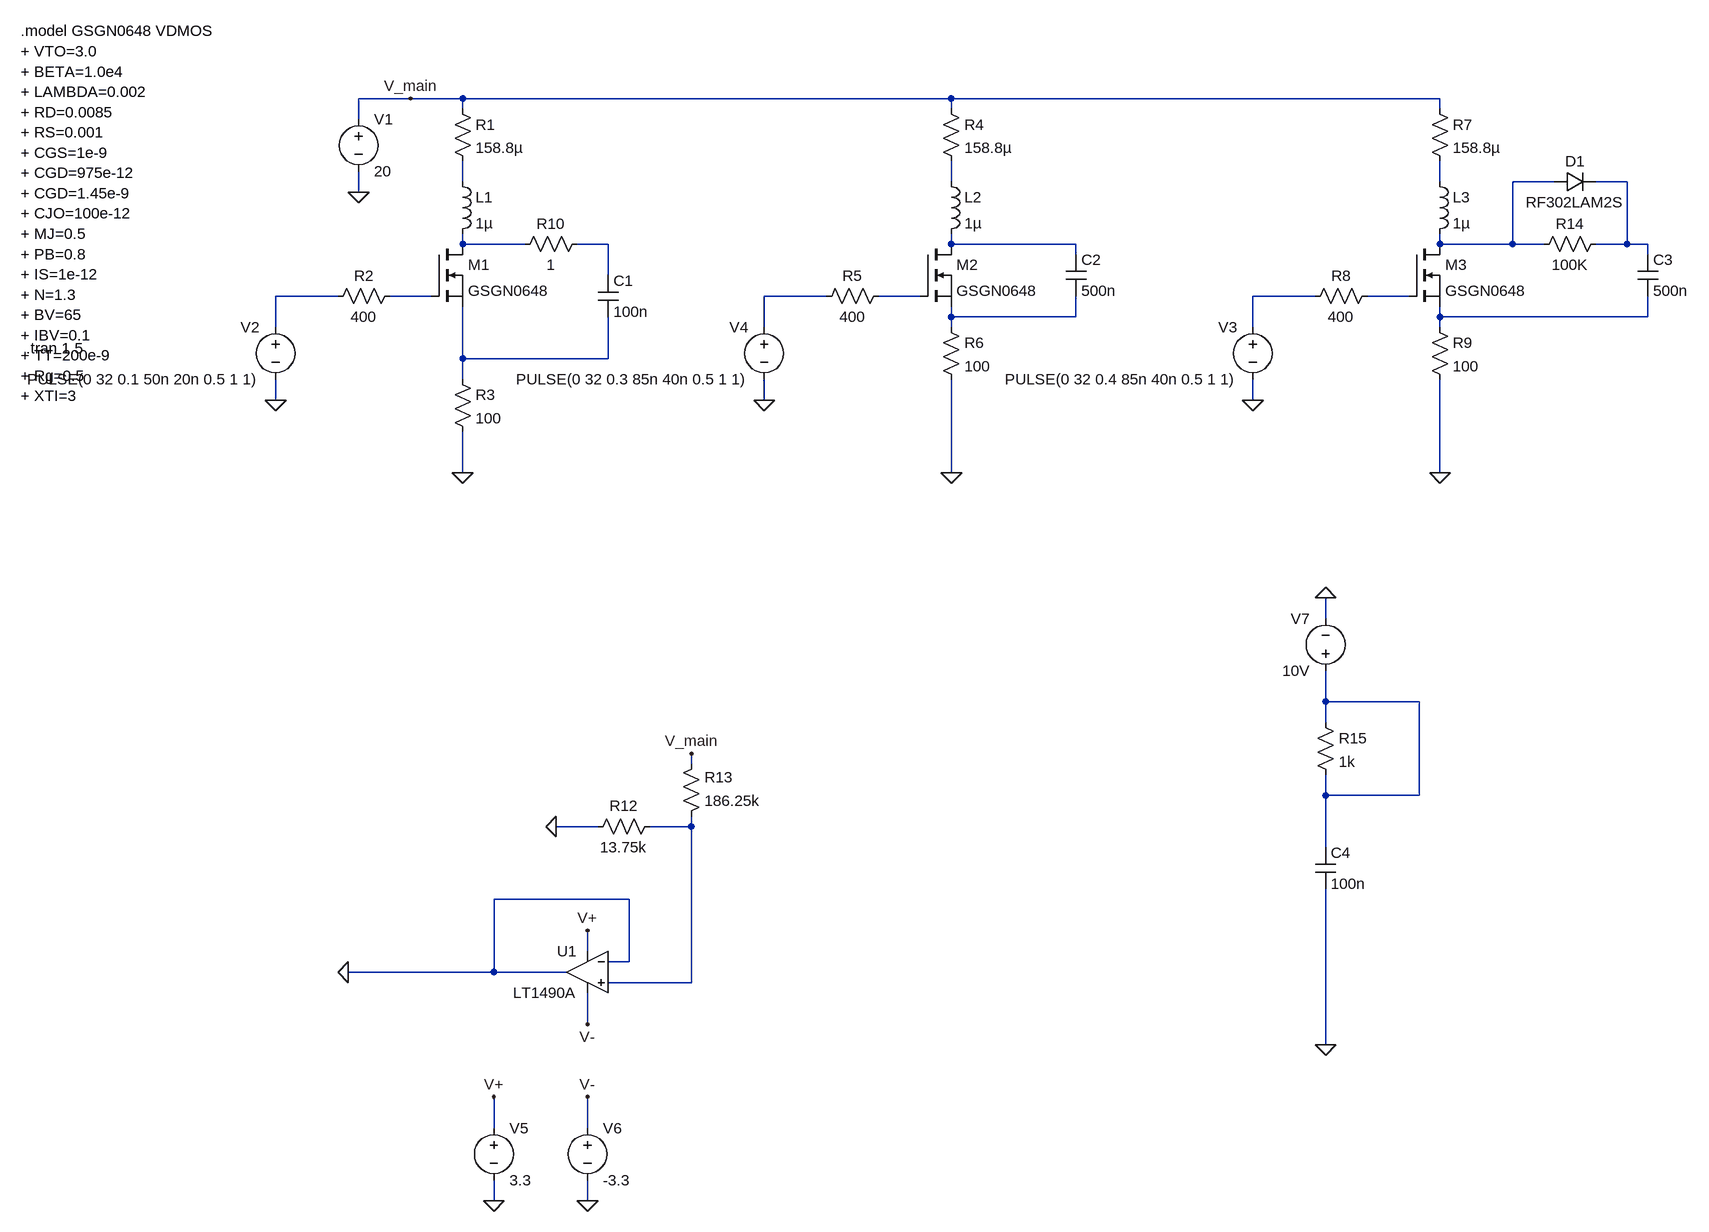
[diagram p0: schematic Snubber_Network.asc]
Snubber_Network.asc, the LTspice schematic file:
Version 4
SHEET 1 3264 1648
WIRE 480 -64 400 -64
WIRE 560 -64 480 -64
WIRE 1312 -64 560 -64
WIRE 2064 -64 1312 -64
WIRE 560 -48 560 -64
WIRE 1312 -48 1312 -64
WIRE 2064 -48 2064 -64
WIRE 400 -32 400 -64
WIRE 560 64 560 32
WIRE 1312 64 1312 32
WIRE 2064 64 2064 32
WIRE 2240 64 2176 64
WIRE 2352 64 2304 64
WIRE 400 80 400 48
WIRE 560 160 560 144
WIRE 656 160 560 160
WIRE 784 160 736 160
WIRE 1312 160 1312 144
WIRE 1504 160 1312 160
WIRE 2064 160 2064 144
WIRE 2176 160 2176 64
WIRE 2176 160 2064 160
WIRE 2224 160 2176 160
WIRE 2352 160 2352 64
WIRE 2352 160 2304 160
WIRE 2384 160 2352 160
WIRE 1504 176 1504 160
WIRE 2384 176 2384 160
WIRE 784 208 784 160
WIRE 368 240 272 240
WIRE 512 240 448 240
WIRE 1120 240 1024 240
WIRE 1264 240 1200 240
WIRE 1872 240 1776 240
WIRE 2016 240 1952 240
WIRE 1312 272 1312 256
WIRE 1504 272 1504 240
WIRE 1504 272 1312 272
WIRE 2064 272 2064 256
WIRE 2384 272 2384 240
WIRE 2384 272 2064 272
WIRE 272 288 272 240
WIRE 1024 288 1024 240
WIRE 1312 288 1312 272
WIRE 1776 288 1776 240
WIRE 2064 288 2064 272
WIRE 560 336 560 256
WIRE 784 336 784 272
WIRE 784 336 560 336
WIRE 560 368 560 336
WIRE 272 400 272 368
WIRE 1024 400 1024 368
WIRE 1776 400 1776 368
WIRE 560 512 560 448
WIRE 1312 512 1312 368
WIRE 2064 512 2064 368
WIRE 1888 736 1888 704
WIRE 1888 864 1888 816
WIRE 2032 864 1888 864
WIRE 1888 896 1888 864
WIRE 912 960 912 944
WIRE 1888 1008 1888 976
WIRE 2032 1008 2032 864
WIRE 2032 1008 1888 1008
WIRE 768 1056 704 1056
WIRE 912 1056 912 1040
WIRE 912 1056 848 1056
WIRE 1888 1088 1888 1008
WIRE 816 1168 608 1168
WIRE 752 1248 752 1216
WIRE 816 1264 816 1168
WIRE 816 1264 784 1264
WIRE 608 1280 608 1168
WIRE 608 1280 384 1280
WIRE 720 1280 608 1280
WIRE 912 1296 912 1056
WIRE 912 1296 784 1296
WIRE 752 1360 752 1312
WIRE 1888 1392 1888 1152
WIRE 608 1520 608 1472
WIRE 752 1520 752 1472
WIRE 608 1632 608 1600
WIRE 752 1632 752 1600
FLAG 560 512 0
FLAG 400 80 0
FLAG 272 400 0
FLAG 1312 512 0
FLAG 1024 400 0
FLAG 2064 512 0
FLAG 1776 400 0
FLAG 608 1632 0
FLAG 608 1472 V+
FLAG 752 1216 V+
FLAG 752 1632 0
FLAG 752 1472 V-
FLAG 752 1360 V-
FLAG 704 1056 0
FLAG 480 -64 V_main
FLAG 912 944 V_main
FLAG 384 1280 0
FLAG 1888 1392 0
FLAG 1888 704 0
SYMBOL voltage 400 -48 R0
SYMATTR InstName V1
SYMATTR Value 20
SYMBOL voltage 272 272 M0
SYMATTR InstName V2
SYMATTR Value PULSE(0 32 0.1 50n 20n 0.5 1 1)
SYMBOL Ind 544 48 R0
SYMATTR InstName L1
SYMATTR Value 1µ
SYMBOL Res 544 -64 R0
SYMATTR InstName R1
SYMATTR Value 158.8µ
SYMBOL Res 464 224 R90
WINDOW 0 0 56 VBottom 2
WINDOW 3 32 56 VTop 2
SYMATTR InstName R2
SYMATTR Value 400
SYMBOL nmos 512 160 R0
SYMATTR InstName M1
SYMATTR Value GSGN0648
SYMBOL voltage 1024 272 M0
SYMATTR InstName V4
SYMATTR Value PULSE(0 32 0.3 85n 40n 0.5 1 1)
SYMBOL Ind 1296 48 R0
SYMATTR InstName L2
SYMATTR Value 1µ
SYMBOL Res 1296 -64 R0
SYMATTR InstName R4
SYMATTR Value 158.8µ
SYMBOL Res 1216 224 R90
WINDOW 0 0 56 VBottom 2
WINDOW 3 32 56 VTop 2
SYMATTR InstName R5
SYMATTR Value 400
SYMBOL Res 1296 272 R0
SYMATTR InstName R6
SYMATTR Value 100
SYMBOL nmos 1264 160 R0
SYMATTR InstName M2
SYMATTR Value GSGN0648
SYMBOL voltage 1776 272 M0
SYMATTR InstName V3
SYMATTR Value PULSE(0 32 0.4 85n 40n 0.5 1 1)
SYMBOL Ind 2048 48 R0
SYMATTR InstName L3
SYMATTR Value 1µ
SYMBOL Res 2048 -64 R0
SYMATTR InstName R7
SYMATTR Value 158.8µ
SYMBOL Res 1968 224 R90
WINDOW 0 0 56 VBottom 2
WINDOW 3 32 56 VTop 2
SYMATTR InstName R8
SYMATTR Value 400
SYMBOL Res 2048 272 R0
SYMATTR InstName R9
SYMATTR Value 100
SYMBOL nmos 2016 160 R0
SYMATTR InstName M3
SYMATTR Value GSGN0648
SYMBOL LT1490A 752 1216 M0
SYMATTR InstName U1
SYMBOL voltage 608 1504 R0
SYMATTR InstName V5
SYMATTR Value 3.3
SYMBOL voltage 752 1504 R0
SYMATTR InstName V6
SYMATTR Value -3.3
SYMBOL Res 864 1040 R90
WINDOW 0 0 56 VBottom 2
WINDOW 3 32 56 VTop 2
SYMATTR InstName R12
SYMATTR Value 13.75k
SYMBOL Res 896 1056 M180
WINDOW 0 36 76 Left 2
WINDOW 3 36 40 Left 2
SYMATTR InstName R13
SYMATTR Value 186.25k
SYMBOL Res 752 144 R90
WINDOW 0 0 56 VBottom 2
WINDOW 3 32 56 VTop 2
SYMATTR InstName R10
SYMATTR Value 1
SYMBOL Cap 768 208 R0
SYMATTR InstName C1
SYMATTR Value 100n
SYMBOL Res 544 352 R0
SYMATTR InstName R3
SYMATTR Value 100
SYMBOL Cap 1488 176 R0
SYMATTR InstName C2
SYMATTR Value 500n
SYMBOL Cap 2368 176 R0
SYMATTR InstName C3
SYMATTR Value 500n
SYMBOL Res 2320 144 R90
WINDOW 0 0 56 VBottom 2
WINDOW 3 32 56 VTop 2
SYMATTR InstName R14
SYMATTR Value 100K
SYMBOL diode 2240 80 R270
WINDOW 0 32 32 VTop 2
WINDOW 3 0 32 VBottom 2
SYMATTR InstName D1
SYMATTR Value RF302LAM2S
SYMBOL voltage 1888 832 R180
WINDOW 0 24 96 Left 2
WINDOW 3 24 16 Left 2
SYMATTR InstName V7
SYMATTR Value 10V
SYMBOL Res 1872 880 R0
SYMATTR InstName R15
SYMATTR Value 1k
SYMBOL Cap 1872 1088 R0
SYMATTR InstName C4
SYMATTR Value 100n
TEXT -112 320 Left 2 !.tran 1.5
TEXT -120 -168 Left 2 !.model GSGN0648 VDMOS\n+ VTO=3.0\n+ BETA=1.0e4\n+ LAMBDA=0.002\n+ RD=0.0085\n+ RS=0.001\n+ CGS=1e-9\n+ CGD=975e-12\n+ CGD=1.45e-9\n+ CJO=100e-12\n+ MJ=0.5\n+ PB=0.8\n+ IS=1e-12\n+ N=1.3\n+ BV=65\n+ IBV=0.1\n+ TT=200e-9\n+ Rg=0.5\n+ XTI=3

The netlist it stands for:
* Snubber_Network.asc
V1 V_main 0 20
V2 N009 0 PULSE(0 32 0.1 50n 20n 0.5 1 1)
L1 N001 N006 1µ
R1 V_main N001 158.8µ
R2 N010 N009 400
M1 N006 N010 N017 N017 GSGN0648
V4 N011 0 PULSE(0 32 0.3 85n 40n 0.5 1 1)
L2 N002 N008 1µ
R4 V_main N002 158.8µ
R5 N012 N011 400
R6 N015 0 100
M2 N008 N012 N015 N015 GSGN0648
V3 N013 0 PULSE(0 32 0.4 85n 40n 0.5 1 1)
L3 N003 N004 1µ
R7 V_main N003 158.8µ
R8 N014 N013 400
R9 N016 0 100
M3 N004 N014 N016 N016 GSGN0648
* U1: LT1490A (symbol LT1490A not available, pins judged from their places): In+=N019 In-=0 V+=V+ V-=V- OUT=0
V5 V+ 0 3.3
V6 V- 0 -3.3
R12 N019 0 13.75k
R13 N019 V_main 186.25k
R10 N007 N006 1
C1 N007 N017 100n
R3 N017 0 100
C2 N008 N015 500n
C3 N005 N016 500n
R14 N005 N004 100K
D1 N004 N005 RF302LAM2S
V7 N018 0 10V
R15 N018 N018 1k
C4 N018 0 100n
.model D D
.lib standard.dio
.model NMOS NMOS
.model PMOS PMOS
.lib standard.mos
.tran 1.5
.model GSGN0648 VDMOS
+ VTO=3.0
+ BETA=1.0e4
+ LAMBDA=0.002
+ RD=0.0085
+ RS=0.001
+ CGS=1e-9
+ CGD=975e-12
+ CGD=1.45e-9
+ CJO=100e-12
+ MJ=0.5
+ PB=0.8
+ IS=1e-12
+ N=1.3
+ BV=65
+ IBV=0.1
+ TT=200e-9
+ Rg=0.5
+ XTI=3
.backanno
.end